# Altium schematic sheet [5] Fans_Control.SchDoc
size A4
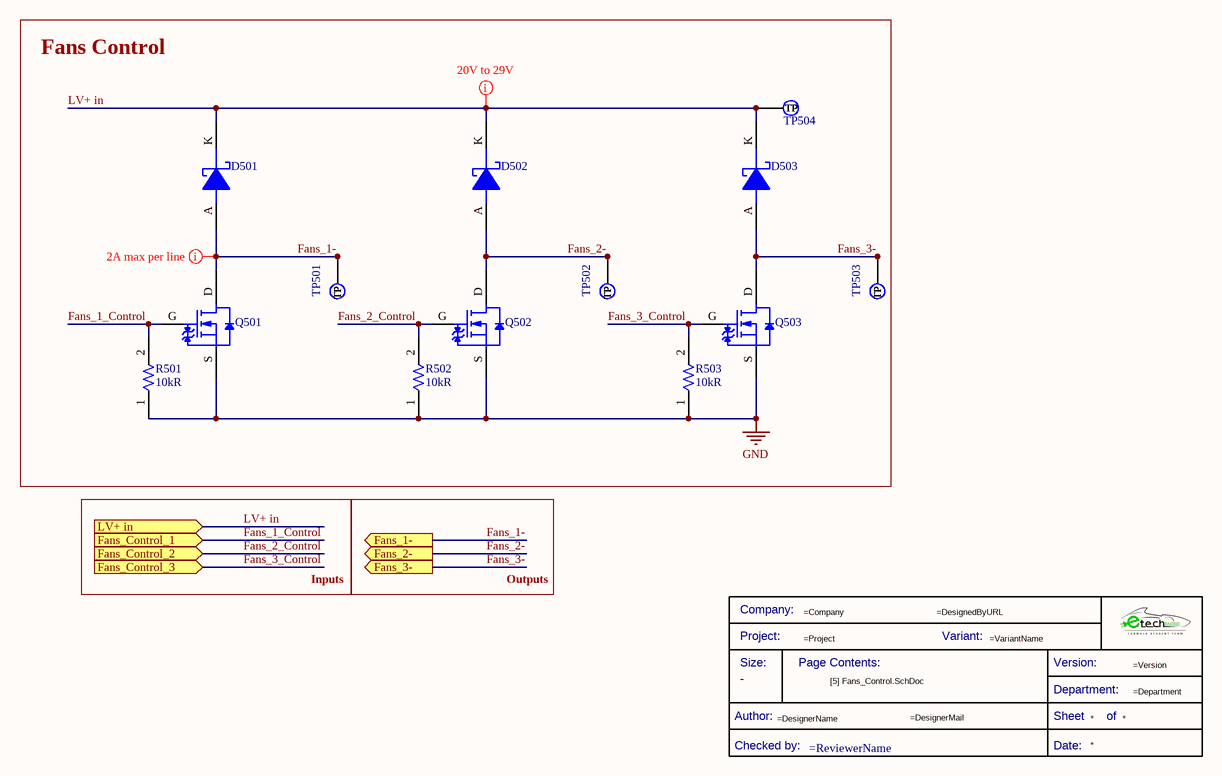
[diagram p0: [5] Fans_Control.SchDoc]

## Parts
*  Title Block_template  (value not drawn)  (graphical)
D501  MBR0530  [DSC-SOD123]  (value not drawn)
D502  MBR0530  [DSC-SOD123]  (value not drawn)
D503  MBR0530  [DSC-SOD123]  (value not drawn)
Q501  CPH3455-TL-H  [TRT-NCH-3/35-CPH]  (value not drawn)
Q502  CPH3455-TL-H  [TRT-NCH-3/35-CPH]  (value not drawn)
Q503  CPH3455-TL-H  [TRT-NCH-3/35-CPH]  (value not drawn)
R501  Resistance: 10kR  [R0805FTK]  (hidden comment: CR0805-JW-103ELF)
R502  Resistance: 10kR  [R0805FTK]  (hidden comment: CR0805-JW-103ELF)
R503  Resistance: 10kR  [R0805FTK]  (hidden comment: CR0805-JW-103ELF)
TP501  TestPoint  [TestPoint]  (value not drawn)  (no BOM)
TP502  TestPoint  [TestPoint]  (value not drawn)  (no BOM)
TP503  TestPoint  [TestPoint]  (value not drawn)  (no BOM)
TP504  TestPoint  [TestPoint]  (value not drawn)  (no BOM)

## Blocks framed on the sheet
Fans Control: D501-D503 Q501-Q503 R501-R503 TP501-TP504

## Ports
Fans_1- (out), Fans_2- (out), Fans_3- (out), Fans_Control_1 (in), Fans_Control_2 (in), Fans_Control_3 (in), LV+ in (in)

## Nets
GND: Q501.S Q502.S Q503.S R501.1 R502.1 R503.1
Fans_1-: D501.A Q501.D TP501.1(TP) ; port Fans_1-
Fans_1_Control: Q501.G R501.2 ; port Fans_Control_1
Fans_2-: D502.A Q502.D TP502.1(TP) ; port Fans_2-
Fans_2_Control: Q502.G R502.2 ; port Fans_Control_2
Fans_3-: D503.A Q503.D TP503.1(TP) ; port Fans_3-
Fans_3_Control: Q503.G R503.2 ; port Fans_Control_3
LV+ in: D501.K D502.K D503.K TP504.1(TP) ; port LV+ in

## Layout directives
mark named 20V to 29V: LV+ in
mark named 2A max per line: Fans_1-

## Notes on the sheet
- Inputs
- Outputs
- Title
- Size:
- Date:
- A4
- Number:
- Time:
- Revision:
- Sheet
- of
- File:
- (in symbol Title Block_template) Company:; Project:; Variant:; Size:; Page Contents:; Version:; Department:; Author:; Sheet; of; Checked by:; Date:

## Library data of the parts
* = Title Block_template: Standard Title Block; Category: Title Block; Checked by:: =ReviewerName; Size: -
D501-D503 = DSC-0.5/30-SOD123: VR=30V IF=500mA 30pF P=410mW; Element Configuration: Single; Forward Voltage: 430mV; Peak Non-Repetitive Surge Current: 5.5A; Average Rectified Current: 500mA; Max Reverse Leakage Current: 130uA; Max Reverse Voltage (DC): 30V; Polarity: Standard; .Creator: GP; Category: Diode; ComponentLink1Description: Datasheet; ComponentLink1URL: *; ComponentLink2Description: Where buy it; ComponentLink2URL: *; Supplier 1: Newark; Stock 1: 9; Pricing 1: 1=0,34400, 10=0,23900, 100=0,12200, 500=0,10000 (USD); Mount: Surface Mount; Contact Plating: Tin,Matte; Weight: 0.03g; Package Quantity: 1; Max Surge Current: 5.5A; Forward Current: 500mA; Max Reverse Current: 130uA; Max Repetitive Reverse Voltage (Vrrm): 30V; Max Forward Surge Current (Ifsm): 5.5A; Voltage Rating (DC): 30V; Current Rating: 500mA; Output Current: 500mA; Series: -; Length: 2.7mm; Width: 1.6mm; Height: 1.03mm; Radiation Hardening: No; RoHS Compliant: Yes; REACH SVHC: No SVHC; Lead Free: Lead Free; ComponentLink3URL: https://datasheet.ciiva.com/30479/0900766b810e2512-30479401.pdf?src-supplier=RSComponents; ComponentLink3Description: https://datasheet.ciiva.com/30479/0900766b810e2512-30479401.pdf?src-supplier=RSComponents; ComponentLink4URL: https://datasheet.ciiva.com/34301/974753-34301826.pdf?src-supplier=Jameco; ComponentLink4Description: https://datasheet.ciiva.com/34301/974753-34301826.pdf?src-supplier=Jameco; ComponentLink5URL: https://datasheet.ciiva.com/910/mbr0530-910516.pdf?src-supplier=Digi-Key; ComponentLink5Description: https://datasheet.ciiva.com/910/mbr0530-910516.pdf?src-supplier=Digi-Key; ComponentLink6URL: https://datasheet.ciiva.com/25931/mbr0530-25931989.pdf?src-supplier=Avnet+Europe; ComponentLink6Description: https://datasheet.ciiva.com/25931/mbr0530-25931989.pdf?src-supplier=Avnet+Europe; ComponentLink7URL: https://datasheet.ciiva.com/8300/mbr0530-8300905.pdf?src-supplier=Avnet; ComponentLink7Description: https://datasheet.ciiva.com/8300/mbr0530-8300905.pdf?src-supplier=Avnet; ComponentLink8URL: https://datasheet.ciiva.com/17318/mbr0530-17318568.pdf?src-supplier=Future+Electronics; ComponentLink8Description: https://datasheet.ciiva.com/17318/mbr0530-17318568.pdf?src-supplier=Future+Electronics; ComponentLink9URL: https://datasheet.ciiva.com/15144/getdatasheetpartid-86760-15144598.pdf?src-supplier=Verical; ComponentLink9Description: https://datasheet.ciiva.com/15144/getdatasheetpartid-86760-15144598.pdf?src-supplier=Verical; ComponentLink10URL: https://datasheet.ciiva.com/910/mbr0530-910518.pdf?src-supplier=Digi-Key; ComponentLink10Description: https://datasheet.ciiva.com/910/mbr0530-910518.pdf?src-supplier=Digi-Key; Supplier Part Number 1: 15R3453
Q501-Q503 = TRT-NCH-3/35-CPH: CPH3455-TL-H N-channel MOSFET Transistor; 3 A; 35 V; 3-Pin CPH; Manufacturer: ON Semiconductor; Rds On Max: 104mR; Input Capacitance: 186pF; Rise Time: 4.7ns; Drain to Source Voltage (Vdss): 35V; Continuous Drain Current (ID): 3A; Max Power Dissipation: 1W; Drain to Source Resistance: 108mR; Turn-On Delay Time: 4.2ns; Turn-Off Delay Time: 15ns; Fall Time: 5.7ns; Element Configuration: Single; Gate to Source Voltage (Vgs): 20V; .Creator: GP; Category: Transistor; ComponentLink1Description: Datasheet; ComponentLink1URL: https://docs.rs-online.com/5847/0900766b812d514d.pdf; ComponentLink2Description: Where buy it; ComponentLink2URL: https://es.rs-online.com/web/p/mosfet/8009989; Supplier 1: RSComponents; Manufacturer Part Number: CPH3455-TL-H; RoHS: Yes; Stock 1: 1; Pricing 1: 50=0,50400 (USD); Case/Package: SC; Number of Pins: 3; Min Operating Temperature: -55°C; Max Operating Temperature: 150°C; Package Quantity: 3000; Packaging: Tape and Reel; Drain to Source Breakdown Voltage: 35V; Power Dissipation: 1W; Polarity: N-CHANNEL; Series: -; Length: 2.9mm; Width: 1.6mm; Height: 0.9mm; Lead Free: Lead Free; Halogen Free: Halogen Free; RoHS Compliant: Yes; ComponentLink3URL: https://datasheet.ciiva.com/947/cph3455-d-947201.pdf?src-supplier=Digi-Key; ComponentLink3Description: https://datasheet.ciiva.com/947/cph3455-d-947201.pdf?src-supplier=Digi-Key; ComponentLink4URL: https://datasheet.ciiva.com/4444/cph3455-d-91653-4444616.pdf?src-supplier=Mouser; ComponentLink4Description: https://datasheet.ciiva.com/4444/cph3455-d-91653-4444616.pdf?src-supplier=Mouser; ComponentLink5URL: https://datasheet.ciiva.com/11164/cph3455-d-11164889.pdf?src-supplier=Avnet; ComponentLink5Description: https://datasheet.ciiva.com/11164/cph3455-d-11164889.pdf?src-supplier=Avnet; Supplier Part Number 1: 8009989
R501-R503 = R10k-0805FTK: BOURNS         CR0805-JW-103ELF            Surface Mount Chip Resistor, Thick Film, CR Series, 10 kohm, 125 mW,  5%, 150 V; Temperature Coefficient: 200ppm/°C; Power Rating: 125mW; Voltage Rating: 150V; Voltage Rating (DC): 100V; .Creator: DR; Supplier 1: Arrow Electronics; Manufacturer 1: Bourns; Manufacturer Part Number 1: CR0805-JW-103ELF; RoHS: Yes; Category: Chip SMD Resistors; Stock 1: 57566; Pricing 1: 1=0,05790, 10=0,01540, 25=0,01340, 100=0,00340 (USD); Mount: Surface Mount; Case/Package: 0805; Number of Pins: 2; Contact Plating: Tin; Case Code (Metric): 2012; Case Code (Imperial): 0805; Min Operating Temperature: -55°C; Max Operating Temperature: 155°C; Tolerance: 5%; Resistor Type: Thick Film; Package Quantity: 1; Packaging: Tape and Reel; Number of Terminations: 2; Termination: SMD/SMT; Max Power Dissipation: 125mW; Features: Moisture Resistant; Series: CR0805; Construction: Rectangular; Resistance Tolerance: 5%; Technology: THICK FILM; Length: 2mm; Width: 1.25mm; Height: 0.5mm; Depth: 1.25mm; Thickness: 508um; Radiation Hardening: No; REACH SVHC: No SVHC; Military Standard: Not; RoHS Compliant: Yes; ComponentLink1URL: https://datasheet.ciiva.com/11821/0900766b80fcdb72-11821135.pdf?src-supplier=RSComponents; ComponentLink1Description: https://datasheet.ciiva.com/11821/0900766b80fcdb72-11821135.pdf?src-supplier=RSComponents; ComponentLink2URL: https://datasheet.ciiva.com/9122/chpreztr-9122374.pdf?src-supplier=Avnet; ComponentLink2Description: https://datasheet.ciiva.com/9122/chpreztr-9122374.pdf?src-supplier=Avnet; ComponentLink3URL: https://datasheet.ciiva.com/22693/1902866-22693254.pdf?src-supplier=Element14; ComponentLink3Description: https://datasheet.ciiva.com/22693/1902866-22693254.pdf?src-supplier=Element14; ComponentLink4URL: https://datasheet.ciiva.com/7986/691949-7986187.pdf?src-supplier=Element14; ComponentLink4Description: https://datasheet.ciiva.com/7986/691949-7986187.pdf?src-supplier=Element14; ComponentLink5URL: https://datasheet.ciiva.com/30065/159chpreztr-30065976.pdf?src-supplier=Onlinecomponents.com; ComponentLink5Description: https://datasheet.ciiva.com/30065/159chpreztr-30065976.pdf?src-supplier=Onlinecomponents.com; ComponentLink6URL: https://datasheet.ciiva.com/16783/70154685-16783482.pdf?src-supplier=Allied+Electronics; ComponentLink6Description: https://datasheet.ciiva.com/16783/70154685-16783482.pdf?src-supplier=Allied+Electronics; ComponentLink7URL: https://datasheet.ciiva.com/5548/chpreztr-5548491.pdf?src-supplier=Mouser; ComponentLink7Description: https://datasheet.ciiva.com/5548/chpreztr-5548491.pdf?src-supplier=Mouser; ComponentLink8URL: https://datasheet.ciiva.com/6559/chpreztr-6559900.pdf?src-supplier=Digi-Key; ComponentLink8Description: https://datasheet.ciiva.com/6559/chpreztr-6559900.pdf?src-supplier=Digi-Key; ComponentLink9URL: https://datasheet.ciiva.com/6559/chpreztr-6559901.pdf?src-supplier=Digi-Key; ComponentLink9Description: https://datasheet.ciiva.com/6559/chpreztr-6559901.pdf?src-supplier=Digi-Key; ComponentLink10URL: https://datasheet.ciiva.com/7985/1856384-7985869.pdf?src-supplier=Element14; ComponentLink10Description: https://datasheet.ciiva.com/7985/1856384-7985869.pdf?src-supplier=Element14; ComponentLink11URL: https://datasheet.ciiva.com/48692/001055517-da-01-en-smd-wid-cr0805-jw-103elf-10k-ohm-1-8w-48692118.pdf?src-supplier=Conrad; ComponentLink11Description: https://datasheet.ciiva.com/48692/001055517-da-01-en-smd-wid-cr0805-jw-103elf-10k-ohm-1-8w-48692118.pdf?src-supplier=Conrad; Supplier Part Number 1: CR0805-JW-103ELF
TP501-TP504 = TestPoint: Test Point 1x1 mm; .Creator: GP; Category: TestPoint; .PCBcheck: GP; .SCHcheck: GP